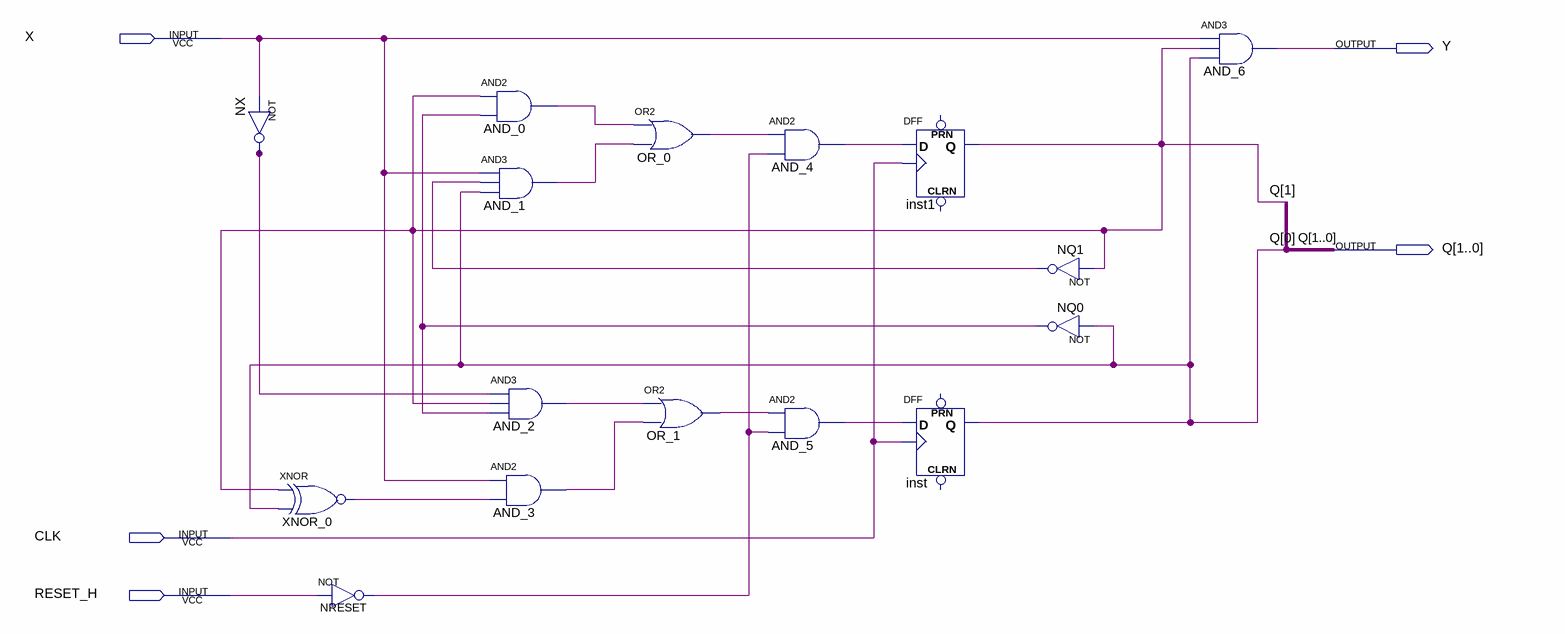
[diagram p0: schematic sheet]
// Quartus schematic MEF.bdf as structural Verilog: 16 symbols, 5 pins
module MEF (
  input  X,
  input  CLK,
  input  RESET_H,
  output Y,
  output [1:0] Q
);

  wire AND_0_out, AND_1_out, AND_2_out, AND_3_out, AND_4_out, AND_5_out, NQ0_out, NQ1_out, NRESET_out,
       NX_out, OR_0_out, OR_1_out, XNOR_0_out;

  not NX (NX_out, X);
  xnor XNOR_0 (XNOR_0_out, Q[1], Q[0]);
  not NRESET (NRESET_out, RESET_H);
  and AND_0 (AND_0_out, Q[1], NQ0_out);
  and AND_1 (AND_1_out, X, NQ1_out, Q[0]);
  and AND_2 (AND_2_out, NX_out, Q[1], NQ0_out);
  and AND_3 (AND_3_out, X, XNOR_0_out);
  or OR_0 (OR_0_out, AND_0_out, AND_1_out);
  or OR_1 (OR_1_out, AND_2_out, AND_3_out);
  and AND_4 (AND_4_out, OR_0_out, NRESET_out);
  and AND_5 (AND_5_out, OR_1_out, NRESET_out);
  DFF inst1 (.CLK(CLK), .D(AND_4_out), .Q(Q[1]));  // open: CLRN, PRN
  DFF inst (.CLK(CLK), .D(AND_5_out), .Q(Q[0]));  // open: CLRN, PRN
  not NQ1 (NQ1_out, Q[1]);
  not NQ0 (NQ0_out, Q[0]);
  and AND_6 (Y, X, Q[1], Q[0]);
endmodule
